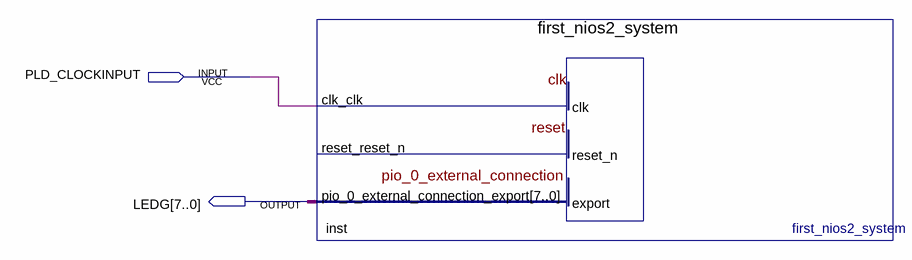
[diagram p0: schematic sheet]
// Quartus schematic nios2_quartus2_project.bdf as structural Verilog: 1 symbols, 2 pins
module nios2_quartus2_project (
  input  PLD_CLOCKINPUT,
  output [7:0] LEDG
);

  first_nios2_system inst (.clk_clk(PLD_CLOCKINPUT), .pio_0_external_connection_export(LEDG));  // open: reset_reset_n
endmodule
